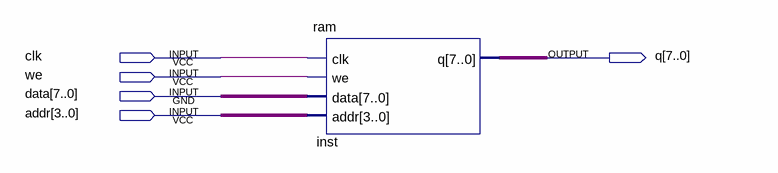
[diagram p0: schematic sheet]
// Quartus schematic Lab4_1.bdf as structural Verilog: 1 symbols, 5 pins
module Lab4_1 (
  input  clk,
  input  we,
  input  [7:0] data,
  input  [3:0] addr,
  output [7:0] q
);

  ram inst (.clk(clk), .we(we), .data(data), .addr(addr), .q(q));
endmodule
